# Altium schematic sheet YA-N-Microcontroller.SchDoc: Yet Another IoT Node - uController
size A4; Revision: 1.0; SheetNumber: 3; SheetTotal: 5
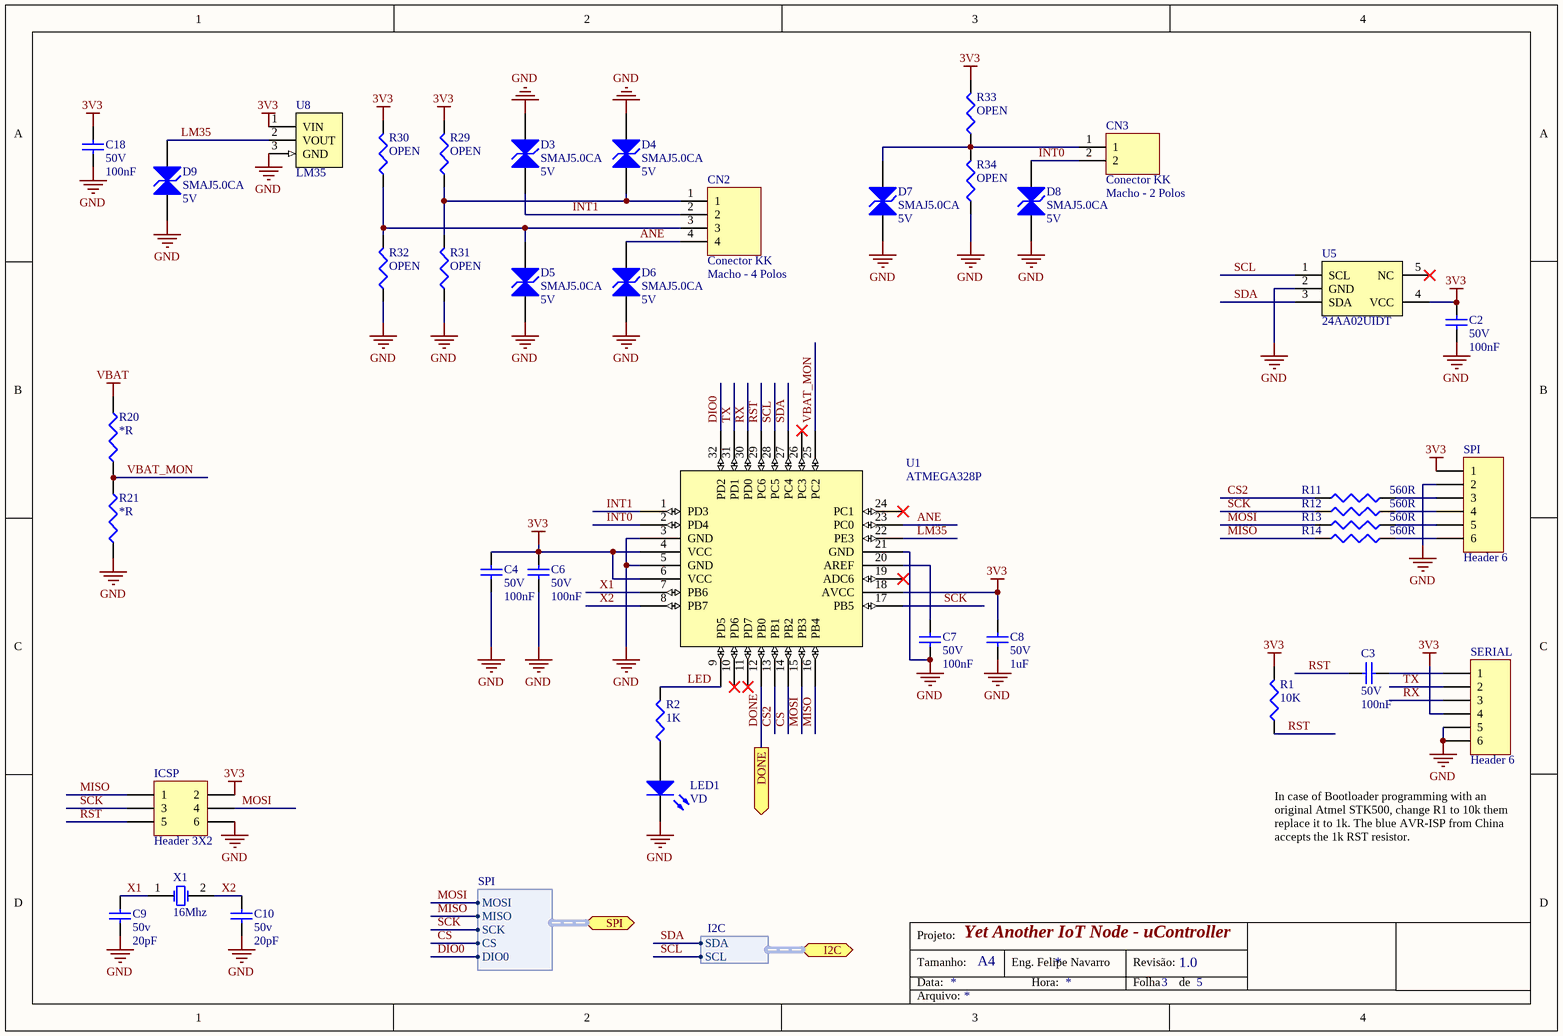
[diagram p0: YA-N-Microcontroller.SchDoc]

## Parts
C2  value 100nF  Tensão: 50V  [CC0603]  (hidden comment: Capacitor Cerâmico)
C3  value 100nF  Tensão: 50V  [CC0603]  (hidden comment: Capacitor Cerâmico)
C4  value 100nF  Tensão: 50V  [CC0603]  (hidden comment: Capacitor Cerâmico)
C6  value 100nF  Tensão: 50V  [CC0603]  (hidden comment: Capacitor Cerâmico)
C7  value 100nF  Tensão: 50V  [CC0603]  (hidden comment: Capacitor Cerâmico)
C8  value 1uF  Tensão: 50V  [CC0603]  (hidden comment: Capacitor Cerâmico)
C9  value 20pF  Tensão: 50v  [CC0603]  (hidden comment: Capacitor Cerâmico)
C10  value 20pF  Tensão: 50v  [CC0603]  (hidden comment: Capacitor Cerâmico)
C18  value 100nF  Tensão: 50V  [CC0603]  (hidden comment: Capacitor Cerâmico)
CN2  Conector KK  value Macho - 4 Polos  [CONN HDR4-POL P.100]
CN3  Conector KK  value Macho - 2 Polos  [CONN HDR2-POL P.100]
D3  SMAJ5.0CA  Tensão: 5V  [SMA BIDIR]
D4  SMAJ5.0CA  Tensão: 5V  [SMA BIDIR]
D5  SMAJ5.0CA  Tensão: 5V  [SMA BIDIR]
D6  SMAJ5.0CA  Tensão: 5V  [SMA BIDIR]
D7  SMAJ5.0CA  Tensão: 5V  [SMA BIDIR]
D8  SMAJ5.0CA  Tensão: 5V  [SMA BIDIR]
D9  SMAJ5.0CA  Tensão: 5V  [SMA BIDIR]
ICSP  Header 3X2  [CONN HDR2X3]
LED1  value VD  [LED 0603]  (hidden comment: LED)
R1  value 10K  [CC0603]  (hidden comment: Resistor)
R2  value 1K  [CC0603]  (hidden comment: Resistor)
R11  value 560R  [CC0603]  (hidden comment: Resistor)
R12  value 560R  [CC0603]  (hidden comment: Resistor)
R13  value 560R  [CC0603]  (hidden comment: Resistor)
R14  value 560R  [CC0603]  (hidden comment: Resistor)
R20  value *R  [CC0603]  (hidden comment: Resistor)
R21  value *R  [CC0603]  (hidden comment: Resistor)
R29  value OPEN  [CC0603]  (hidden comment: Resistor Open)  (no BOM)
R30  value OPEN  [CC0603]  (hidden comment: Resistor Open)  (no BOM)
R31  value OPEN  [CC0603]  (hidden comment: Resistor Open)  (no BOM)
R32  value OPEN  [CC0603]  (hidden comment: Resistor Open)  (no BOM)
R33  value OPEN  [CC0603]  (hidden comment: Resistor Open)  (no BOM)
R34  value OPEN  [CC0603]  (hidden comment: Resistor Open)  (no BOM)
SERIAL  Header 6  [CONN HDR1X6]
SPI  Header 6  [CONN HDR1X6]
U1  ATMEGA328P  [TQFP-32N]
U5  24AA02UIDT  [SOT-23-5N]
U8  LM35  [CONN HDR3-POL P.100]
X1  16Mhz  [HC/49US]

## Ports
DONE (out), I2C (harness I2C), SPI (harness SPI)

## Harnesses
I2C: SDA, SCL
SPI: MOSI, MISO, SCK, CS, DIO0

## Nets
3V3: C2.2 C4.2 C6.2 C8.2 C18.2 ICSP.2 R1.2 R29.2 R30.2 R33.2 SERIAL.4 SPI.1 U1.4(VCC) U1.6(VCC) U1.18(AVCC) U5.4(VCC) U8.1(VIN)
GND: C2.1 C4.1 C6.1 C7.1 C8.1 C9.1 C10.1 C18.1 D3.2(K) D4.2(K) D5.1(A) D6.1(A) D7.1(A) D8.1(A) D9.1(A) ICSP.6 LED1.2(K) R21.1 R31.1 R32.1 R34.1 SERIAL.5 SERIAL.6 SPI.2 U1.3(GND) U1.5(GND) U1.21(GND) U5.2(GND) U8.3(GND)
VBAT: R20.2
ANE: CN2.4 D6.2(K) U1.23(PC0)
CS: U1.14(PB2) ; port SPI.CS
CS2: R11.1 U1.13(PB1)
DIO0: U1.32(PD2) ; port SPI.DIO0
DONE: U1.12(PB0) ; port DONE
INT0: CN3.2 D8.2(K) U1.2(PD4)
INT1: CN2.2 D3.1(A) U1.1(PD3)
LED: R2.2 U1.9(PD5)
LM35: D9.2(K) U1.22(PE3) U8.2(VOUT)
MISO: ICSP.1 R14.1 U1.16(PB4) ; port SPI.MISO
MOSI: ICSP.4 R13.1 U1.15(PB3) ; port SPI.MOSI
RST: C3.2 ICSP.5 R1.1 U1.29(PC6)
RX: SERIAL.3 U1.30(PD0)
SCK: ICSP.3 R12.1 U1.17(PB5) ; port SPI.SCK
SCL: U1.28(PC5) U5.1(SCL) ; port I2C.SCL
SDA: U1.27(PC4) U5.3(SDA) ; port I2C.SDA
TX: SERIAL.2 U1.31(PD1)
VBAT_MON: R20.1 R21.2 U1.25(PC2)
X1: C9.2 U1.7(PB6) X1.1(OSC1)
X2: C10.2 U1.8(PB7) X1.2(OSC2)
NetC3_1: C3.1 SERIAL.1
NetC7_2: C7.2 U1.20(AREF)
NetCN2_1: CN2.1 D4.1(A) R29.1 R31.2
NetCN2_3: CN2.3 D5.2(K) R30.1 R32.2
NetCN3_1: CN3.1 D7.2(K) R33.1 R34.2
NetLED1_1: LED1.1(A) R2.1
NetR11_2: R11.2 SPI.3
NetR12_2: R12.2 SPI.4
NetR13_2: R13.2 SPI.5
NetR14_2: R14.2 SPI.6

Not connected (* = marked no-connect by the designer): U1 10(PD6)* 11(PD7)* 19(ADC6)* 24(PC1)* 26(PC3)*; U5 5(NC)*

## Notes on the sheet
- In case of Bootloader programming with an original Atmel STK500, change R1 to 10k them replace it to 1k. The blue AVR-ISP from China accepts the 1k RST resistor.
- Projeto:
- Tamanho:
- Data:
- A4
- Eng. Felipe Navarro
- Hora:
- Revisão:
- Folha
- de
- Arquivo:

## Library data of the parts
C2-C4 C6 C7 C18 = Cap 100nF 50V 0603 X7R: Capacitor (Semiconductor SIM Model); Chinês: Local; ChinesePrice: 0,00250; Corrente: *A; Potência: *W; Obs:: X7R; Tolerância: ±10%; Supplier 1: Digi-Key; Supplier Part Number 1: 1276-1000-1-ND; ComponentLink1Description: Datasheet; ComponentLink1URL: D:\Tecnoclade\Datasheet\!DataMissing.pdf
C8 = Cap 1uF 50V 0603 X5R: Capacitor (Semiconductor SIM Model); Chinês: Local; ChinesePrice: 0,01100; Corrente: *A; Potência: *W; Obs:: X5R; Tolerância: ±10%; Supplier 1: Digi-Key; Supplier Part Number 1: 587-2400-1-ND; ComponentLink1Description: Datasheet; ComponentLink1URL: D:\Tecnoclade\Datasheet\!DataMissing.pdf
C9 C10 = Cap - $Val $V $Footprint $Classe_1: Capacitor (Semiconductor SIM Model); Chinês: ----; ChinesePrice: 0,00000; Corrente: *A; Potência: *W; Tolerância: ±*%; Supplier 1: Digi-Key; Supplier Part Number 1: 1276-1187-1-ND; Obs:: *; ComponentLink1Description: Datasheet; ComponentLink1URL: D:\Tecnoclade\Datasheet\!DataMissing.pdf
CN2 = KK 4P Macho-V P2.54mm: ChinesePrice: 0,00000; Chinês: ----; Corrente: *; Potência: *; Supplier 1: Digi-Key; Supplier Part Number 1: A19431-ND; Tensão: *; Obs:: *; Tolerância: *; ComponentLink1Description: Datasheet; ComponentLink1URL: D:\Tecnoclade\Datasheet\!DataMissing.pdf
CN3 = KK 2P Macho-V P2.54mm: ChinesePrice: 0,01400; Chinês: Local; Corrente: *; Potência: *; Supplier 1: Digi-Key; Supplier Part Number 1: A19423-ND; Tensão: *; Obs:: *; Tolerância: *; ComponentLink1Description: Datasheet; ComponentLink1URL: D:\Tecnoclade\Datasheet\!DataMissing.pdf
D3-D9 = TVS 5V 5% SMA BI 400W: Transient Voltage Supressor diode; ChinesePrice: 0,00000; Chinês: ----; Potência: 400W; Value: TVS; Obs:: Bidirecional; Tolerância: ±5%; Corrente: *; Supplier 1: Digi-Key; Supplier Part Number 1: SMAJ5.0CABCT-ND; ComponentLink1Description: Datasheet; ComponentLink1URL: D:\Tecnoclade\Datasheet\!DataMissing.pdf
ICSP = Header 3X2: Header, 5-Pin, Dual row; ChinesePrice: 0,00000; Chinês: ----; Value: Macho; Obs:: Barra dupla de 40 pinos - ATENÇÃO; Corrente: *; Potência: *; Supplier 1: Digi-Key; Supplier Part Number 1: 609-3724-ND; Tensão: *; Tolerância: *; ComponentLink1Description: Datasheet; ComponentLink1URL: D:\Tecnoclade\Datasheet\!DataMissing.pdf
LED1 = LED 0603 VD 2V 75mW: ChinesePrice: 0,02810; Chinês: Local; Corrente: 20mA; Potência: 75mW; Tensão: 2V; Obs:: 35mcd@130º; Supplier 1: Digi-Key; Supplier Part Number 1: 160-1478-1-ND; Tolerância: *; ComponentLink1Description: Datasheet; ComponentLink1URL: D:\Tecnoclade\Datasheet\!DataMissing.pdf
R1 = Res 10K 1% 0603 1/10W: ChinesePrice: 0,00089; Chinês: Local; Corrente: *A; Potência: 1/10W; Tensão: *V; Tolerância: ±1%; Supplier 1: Digi-Key; Supplier Part Number 1: P10.0KHCT-ND; Obs: *; ComponentLink1Description: Datasheet; ComponentLink1URL: D:\Tecnoclade\Datasheet\!DataMissing.pdf
R2 = Res 1K 1% 0603 1/10W: ChinesePrice: 0,00089; Chinês: Local; Corrente: *A; Potência: 1/10W; Tensão: *V; Tolerância: ±1%; Supplier 1: Digi-Key; Supplier Part Number 1: RMCF0603FT1K00CT-ND; Obs: *; ComponentLink1Description: Datasheet; ComponentLink1URL: D:\Tecnoclade\Datasheet\!DataMissing.pdf
R11-R14 = Res 560R 1% 0603 1/10w: ChinesePrice: 0,00000; Chinês: ----; Corrente: *A; Potência: 1/10W; Tensão: *V; Tolerância: ±*%; Supplier 1: Digi-Key; Supplier Part Number 1: 311-560HRCT-ND; Obs:: *; ComponentLink1Description: Datasheet; ComponentLink1URL: D:\Tecnoclade\Datasheet\!DataMissing.pdf
R20 R21 = Res - $Val $% $Footprint $Pot: ChinesePrice: 0,00000; Chinês: ----; Corrente: *A; Potência: 1/10W; Tensão: *V; Tolerância: ±*%; Supplier 1: Digi-Key; Supplier Part Number 1: --Del; Obs:: *; ComponentLink1Description: Datasheet; ComponentLink1URL: D:\Tecnoclade\Datasheet\!DataMissing.pdf
R29-R34 = Res Open 0603: Resistor; ChinesePrice: 0,00000; Chinês: ----; Corrente: *A; Potência: *W; Tensão: *V; Tolerância: ±*%; Supplier 1: Digi-Key; Supplier Part Number 1: --Del; Obs:: *; ComponentLink1Description: Datasheet; ComponentLink1URL: D:\Tecnoclade\Datasheet\!DataMissing.pdf
SERIAL SPI = Header 6: Header, 6-Pin; ChinesePrice: 0,10000; Chinês: Proved - Local; Value: Barra de 40 pinos - ATENÇÃO; Corrente: *; Potência: *; Supplier 1: Digi-Key; Supplier Part Number 1: A26509-40-ND; Tensão: *; Obs:: *; Tolerância: *; ComponentLink1Description: Datasheet; ComponentLink1URL: D:\Tecnoclade\Datasheet\!DataMissing.pdf
U1 = ATMEGA328P: IC MCU 32KB FLASH 20MHZ 32TQFP; ChinesePrice: 0,00000; Chinês: ----; Supplier 1: Digi-Key; Supplier Part Number 1: ATMEGA328P-AN-ND; Tensão: *; Corrente: *; Potência: *; Value: *; Obs:: *; Tolerância: *; ComponentLink1Description: Datasheet; ComponentLink1URL: D:\Tecnoclade\Datasheet\
U5 = 24AA02UIDT: IC EEPROM 2KBIT 400KHZ SOT23-5; Tensão: 3V3; ChinesePrice: 0,00000; Chinês: ----; Corrente: 200mA; Potência: *; Supplier 1: Digi-Key; Supplier Part Number 1: 24AA02UIDT-I/OTCT-ND; Value: *; Obs:: *; Tolerância: *; ComponentLink1Description: Datasheet; ComponentLink1URL: D:\Tecnoclade\Datasheet\
U8 = LM35: SIMPLE LM35 Precision Centigrade Temperature Sensors; ChinesePrice: 0,00000; Chinês: ----; Tensão: 3V3; Value: 1MHz; Potência: *; Supplier 1: Digi-Key; Supplier Part Number 1: LM35DZ/NOPB-ND; Tolerância: *; ComponentLink1Description: Datasheet; ComponentLink1URL: http://www.ti.com/lit/ds/symlink/lm35.pdf
X1 = XTAL: Crystal Oscillator; ChinesePrice: 0,00000; Chinês: ----; Value: 20pF/40R; Corrente: *; Potência: *; Supplier 1: Digi-Key; Supplier Part Number 1: 535-10226-1-ND; Tensão: *; Obs:: *; Tolerância: *